# EAGLE design W076Dclone (EAGLE 6.6.0)
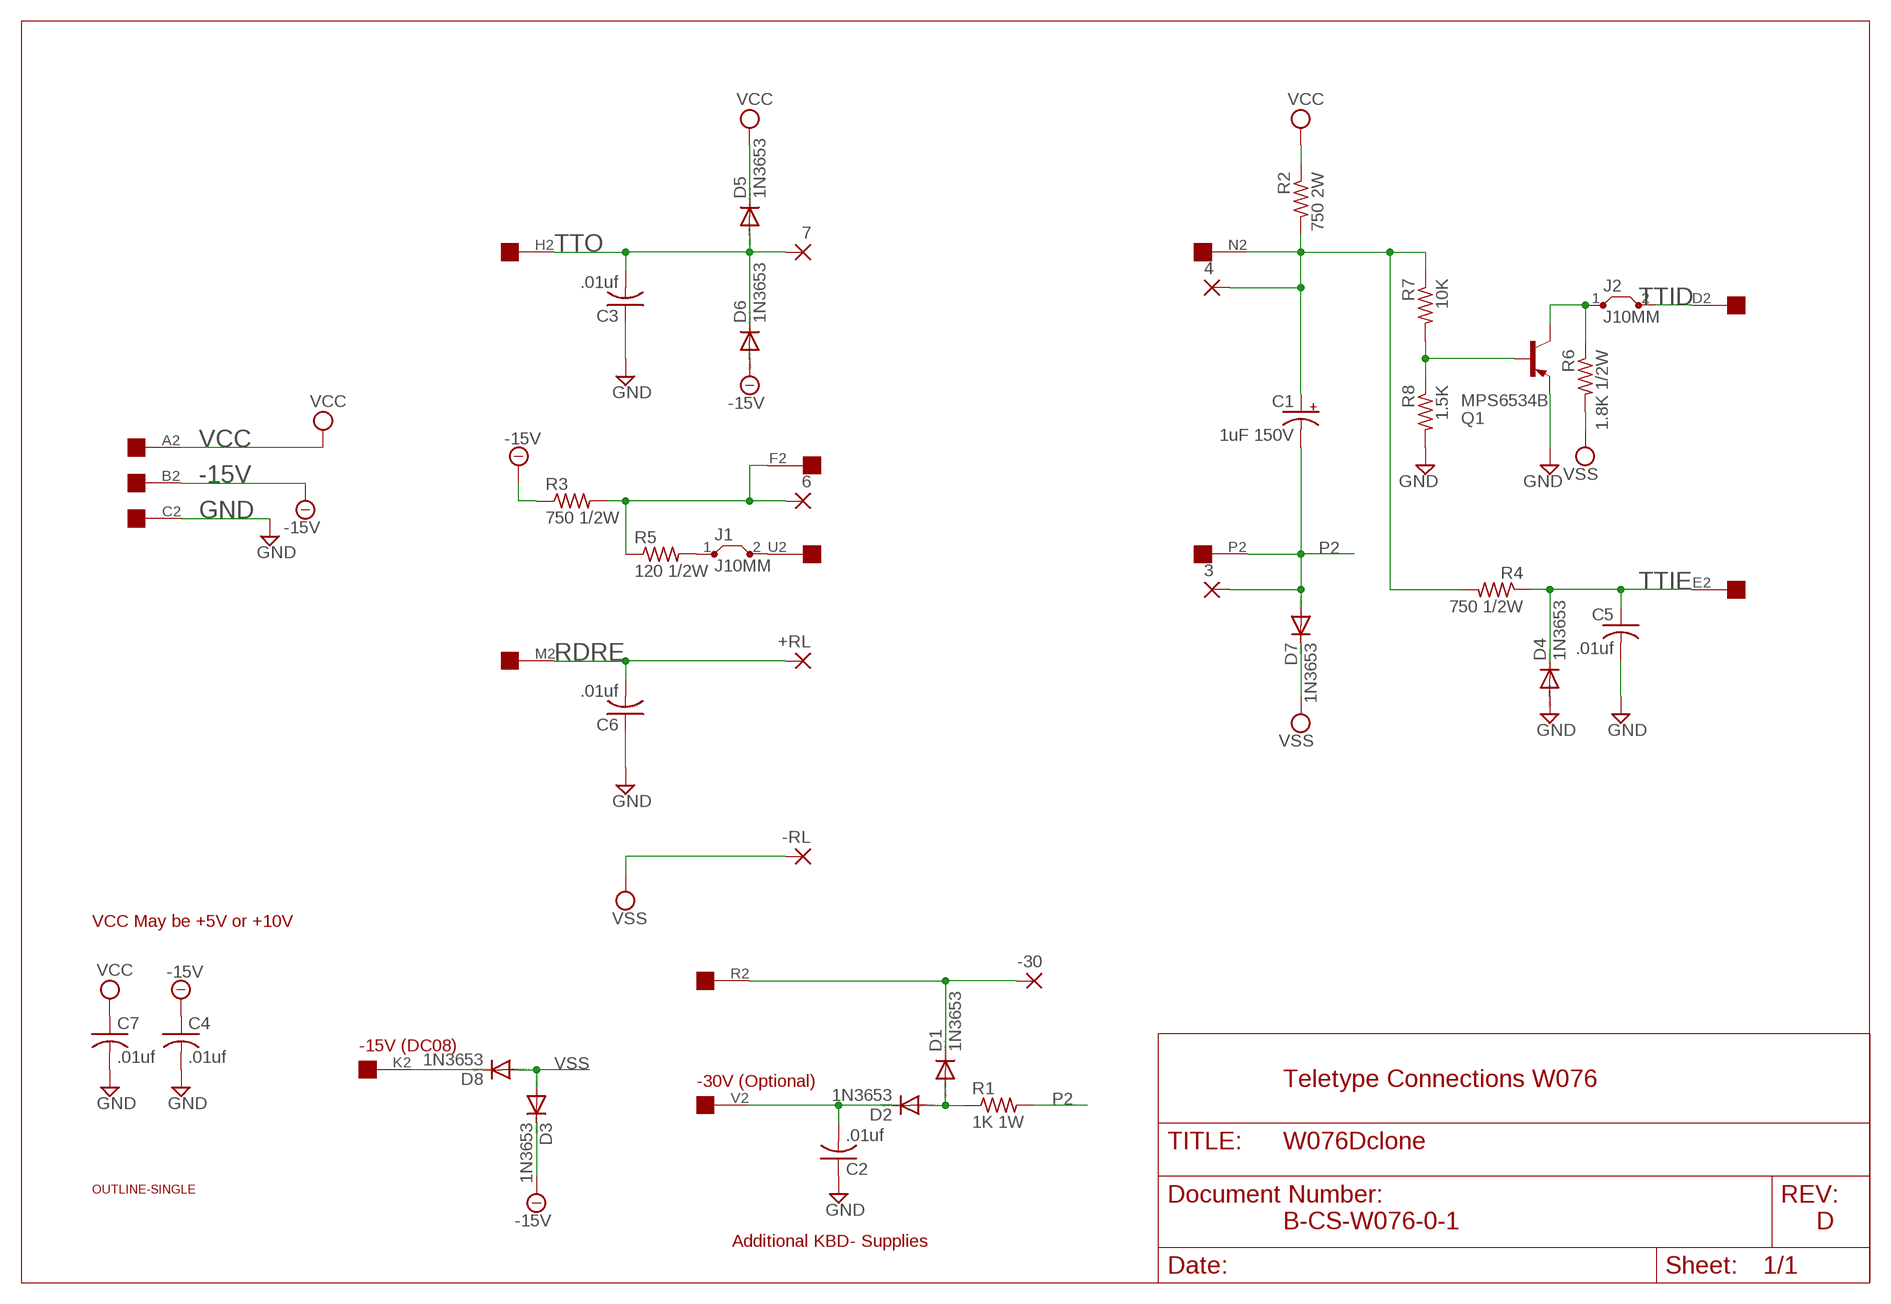
[diagram p0: schematic, sheet 1]

## Parts
3  2,54/1,0  [2,54/1,0]
4  2,54/1,0  [2,54/1,0]
6  2,54/1,0  [2,54/1,0]
7  2,54/1,0  [2,54/1,0]
+RL  2,54/1,0  [2,54/1,0]
-30  2,54/1,0  [2,54/1,0]
-RL  2,54/1,0  [2,54/1,0]
C1  1uF 150V  CPOL-USE25-9AXIAL  [E25-9]
C2  .01uf  C-US050-025X075  [C050-025X075]
C3  .01uf  C-US050-025X075  [C050-025X075]
C4  .01uf  C-US050-025X075  [C050-025X075]
C5  .01uf  C-US050-025X075  [C050-025X075]
C6  .01uf  C-US050-025X075  [C050-025X075]
C7  .01uf  C-US050-025X075  [C050-025X075]
D1  1N3653  1N4148DO35-10  [DO35-10]
D2  1N3653  1N4148DO35-10  [DO35-10]
D3  1N3653  1N4148DO35-10  [DO35-10]
D4  1N3653  1N4148DO35-10  [DO35-10]
D5  1N3653  1N4148DO35-10  [DO35-10]
D6  1N3653  1N4148DO35-10  [DO35-10]
D7  1N3653  1N4148DO35-10  [DO35-10]
D8  1N3653  1N4148DO35-10  [DO35-10]
EDGE  EDGE-1  [EDGE-CON1]
J1  J10MM  [10]
J2  J10MM  [10]
Q1  MPS6534B  2N2904  [TO39]
R1  1K 1W  R-US_0817/22  [P0817/22]
R2  750 2W  R-US_0817/22  [P0817/22]
R3  750 1/2W  R-US_0411/15  [0411/15]
R4  750 1/2W  R-US_0411/15  [0411/15]
R5  120 1/2W  R-US_0411/15  [0411/15]
R6  1.8K 1/2W  R-US_0411/15  [0411/15]
R7  10K  R-US_0411/15  [0411/15]
R8  1.5K  R-US_0411/15  [0411/15]
U$1  OUTLINE-SINGLE  [SINGLE]

## Nets
-15V: C4.1 D3.C D6.A EDGE.B2 R3.1
GND: C2.1 C3.1 C4.2 C5.2 C6.1 C7.2 D4.A EDGE.C2 Q1.1(E) R8.2
N$1: 6.1(P) EDGE.F2 R3.2 R5.1
N$2: Q1.2(B) R7.2 R8.1
N$3: -30.1(P) D1.C EDGE.R2
N$4: D8.C EDGE.K2
N$5: C2.2 D2.C EDGE.V2
N$6: D1.A D2.A R1.1
N$7: 4.1(P) C1.+ EDGE.N2 R2.2 R4.2 R7.1
N$8: J1.1 R5.2
N$9: J2.1 Q1.3(C) R6.1
P2: 3.1(P) C1.- D7.A EDGE.P2 R1.2
RDRE: +RL.1(P) C6.2 EDGE.M2
TTID: EDGE.D2 J2.2
TTIE: C5.1 D4.C EDGE.E2 R4.1
TTO: 7.1(P) C3.2 D5.A D6.C EDGE.H2
TTOE: EDGE.U2 J1.2
VCC: C7.1 D5.C EDGE.A2 R2.1
VSS: -RL.1(P) D3.A D7.C D8.A R6.2
Unconnected: EDGE.J2 EDGE.L2 EDGE.S2 EDGE.T2

## Notes on the sheet
- VCC May be +5V or +10V
- -15V (DC08)
- -30V (Optional) | Teletype Connections W076
- B-CS-W076-0-1 | D
- Additional KBD- Supplies

## Library data of the parts
3 4 6 7 +RL -30 -RL = wirepad:2,54/1,0: THROUGH-HOLE PAD
C1 = rcl:CPOL-US: POLARIZED CAPACITOR, American symbol
C2-C7 = rcl:C-US: CAPACITOR, American symbol
D1-D8 = diode:1N4148: DIODE high speed (Philips)
EDGE = dec-con:EDGE-1: Single-Sided DEC Edge Connector -- (side 2)
J1 J2 = jumper:J: Bridge
Q1 = transistor-pnp:2N2904*: PNP Transistror
R1-R8 = rcl:R-US_: RESISTOR, American symbol
U$1 = dec-con:OUTLINE-*: Board outlines for DEC boards.

## Board
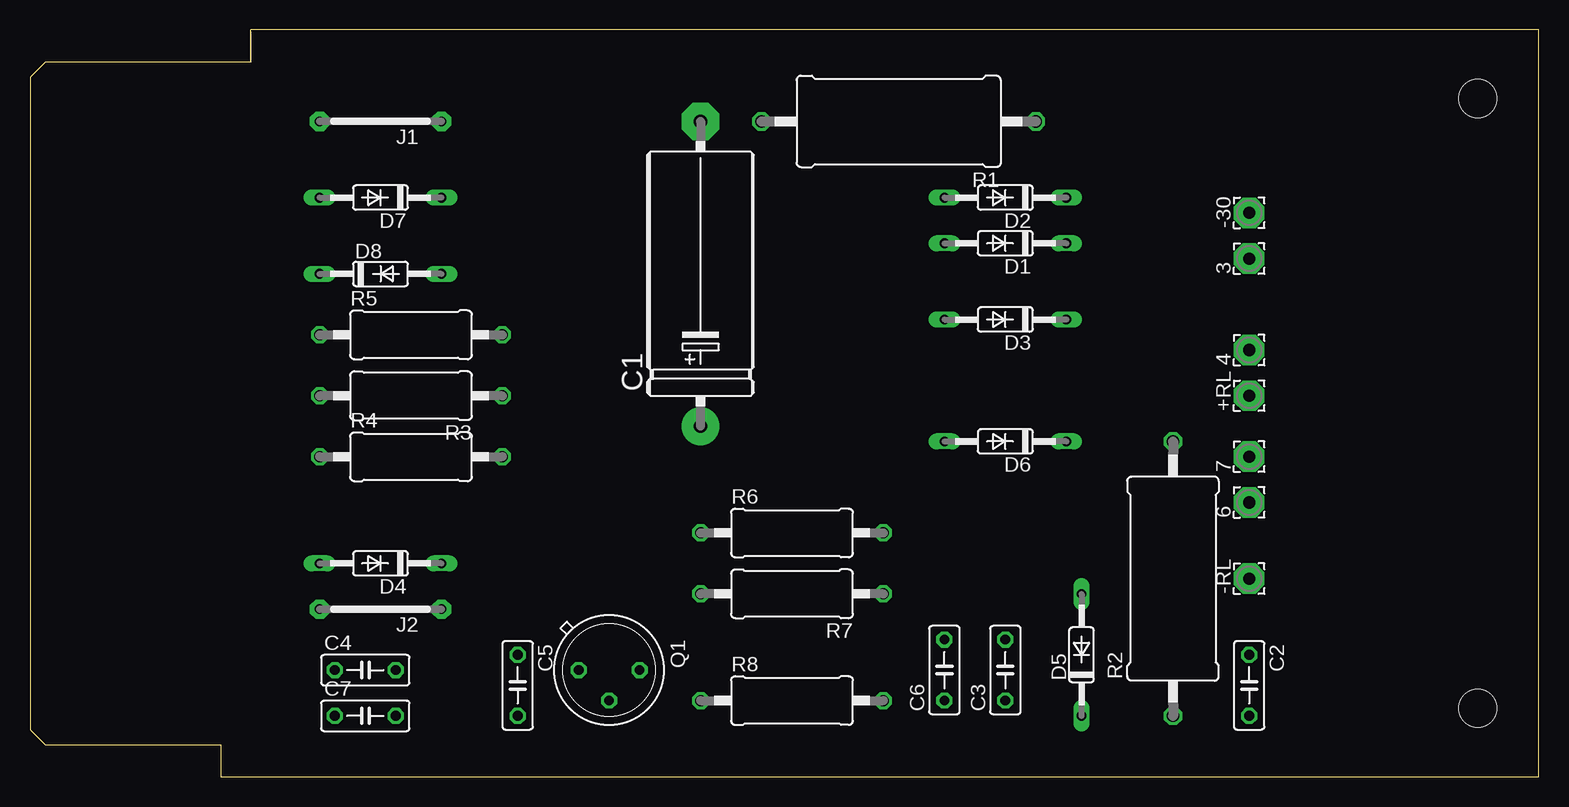
[diagram p1: board, top side]
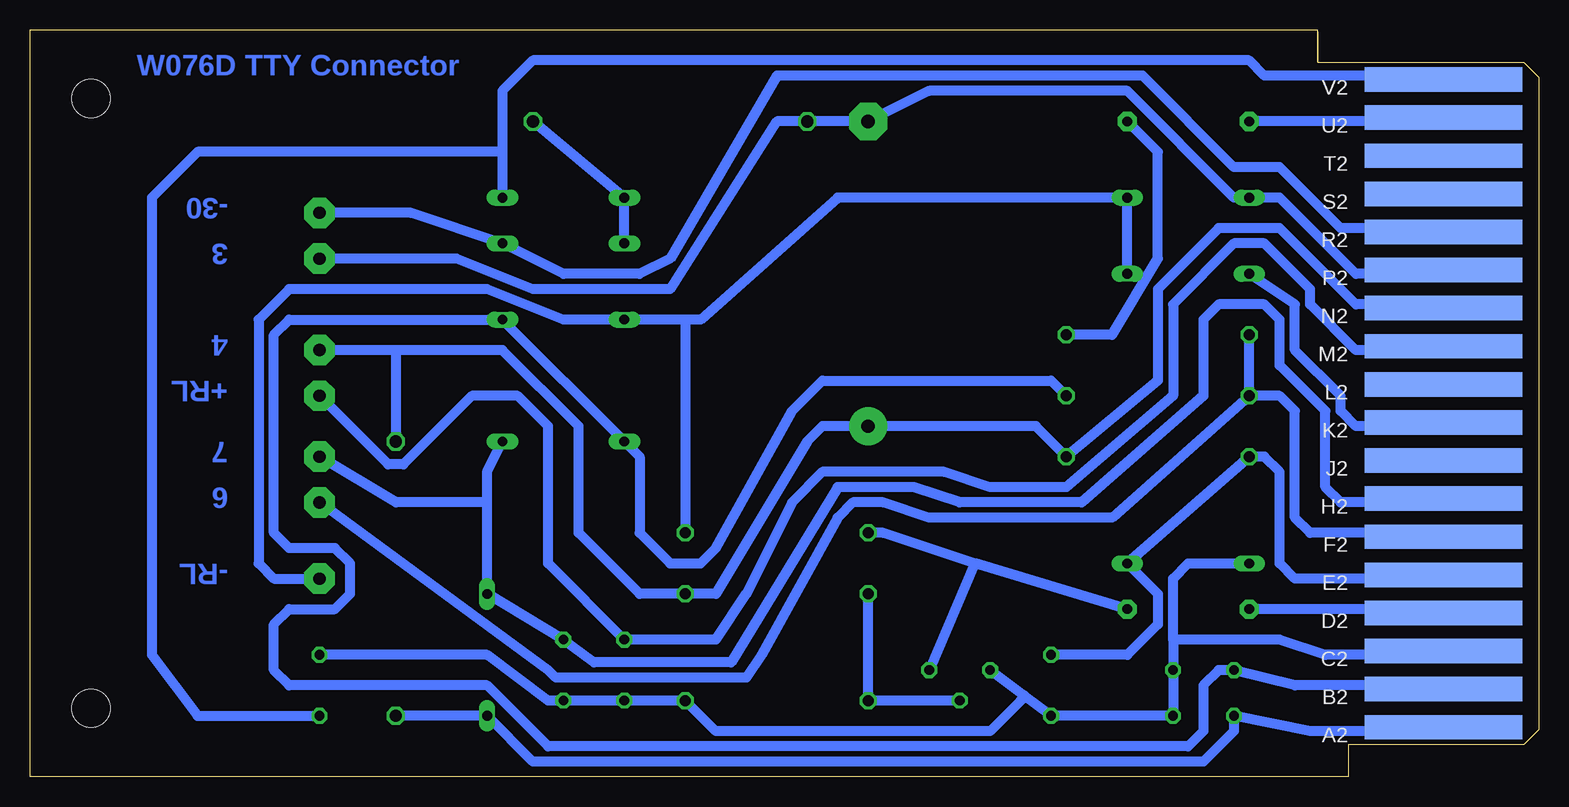
[diagram p2: board, bottom side, seen from below]

Size 125.73 x 62.23 mm. Coordinates in mm from the lower left corner, seen from the top.
Copper layers (1+16): Top 0.035mm / dielectric 1.5mm / Bottom 0.035mm
Design rules "16mils": minimum track width 16mil, minimum drill 32mil, track to track 15mil, track to pad 10mil, pad to pad 10mil, via to via 10mil, smd to smd 10mil, copper to edge 13mil, drill to drill 10mil, minimum pad ring 10mil, minimum via ring 8mil, stop-mask expansion 0mil, vias tented up to drill 0mil, thermal gap 10mil

### Footprints (pad centres in the part's own frame; a part is rotated, then mirrored left to right if it is on the bottom)
2,54/1,0 = drill 1.016 pad 2.54 octagon: 1 0,0
E25-9 = drill 1.118 pad 3.15: + -12.7,0 | drill 1.118 pad 3.15 octagon: - 12.7,0
C050-025X075 = drill 0.813 octagon: 1 -2.54,0; 2 2.54,0
DO35-10 = drill 0.813 long: A 5.08,0; C -5.08,0
EDGE-CON1 = smd 13.106 x 2.032 bottom: A2 7.938,4.128; B2 7.938,7.303; C2 7.938,10.477; D2 7.938,13.652; E2 7.938,16.828; F2 7.938,20.003; H2 7.938,23.177; J2 7.938,26.352; K2 7.938,29.527; L2 7.938,32.703; M2 7.938,35.877; N2 7.938,39.053; P2 7.938,42.227; R2 7.938,45.403; S2 7.938,48.578; T2 7.938,51.752; U2 7.938,54.928; V2 7.938,58.102
10 = drill 0.813 pad 1.6 octagon: 1 -5.08,0; 2 5.08,0
TO39 = drill 0.813 octagon: 1 0,-2.54; 2 2.54,0; 3 0,2.54
P0817/22 = drill 1.016 octagon: 1 -11.43,0; 2 11.43,0
0411/15 = drill 0.914 octagon: 1 -7.62,0; 2 7.62,0
SINGLE = hole 3.175: 120.65,56.515; 120.65,5.715

### Placement (x,y rotation side)
3  101.6,43.18 90 top
4  101.6,35.56 90 top
6  101.6,22.86 90 top
7  101.6,26.67 90 top
+RL  101.6,31.75 90 top
-30  101.6,46.99 90 top
-RL  101.6,16.51 90 top
C1  55.88,41.91 90 top
C2  101.6,7.62 270 top
C3  81.28,8.89 90 top
C4  27.94,8.89 0 top
C5  40.64,7.62 270 top
C6  76.2,8.89 90 top
C7  27.94,5.08 0 top
D1  81.28,44.45 180 top
D2  81.28,48.26 180 top
D3  81.28,38.1 180 top
D4  29.21,17.78 180 top
D5  87.63,10.16 90 top
D6  81.28,27.94 180 top
D7  29.21,48.26 180 top
D8  29.21,41.91 0 top
EDGE  0,0 0 top
J1  29.21,54.61 180 top
J2  29.21,13.97 180 top
Q1  48.26,8.89 270 top
R1  72.39,54.61 180 top
R2  95.25,16.51 90 top
R3  31.75,31.75 180 top
R4  31.75,26.67 0 top
R5  31.75,36.83 0 top
R6  63.5,20.32 0 top
R7  63.5,15.24 180 top
R8  63.5,6.35 0 top
U$1  0,0 0 top

### Tracks (layer width: path | path; a pad name or v marks a point on that pad's centre or on a via)
-15V
  Bottom 0.813: EDGE.B2 8.89,7.62 20.32,7.62 C4.1 26.67,8.89 27.94,7.62 27.94,3.81 29.21,2.54 82.55,2.54 87.63,7.62 104.14,7.62 105.41,8.89 105.41,12.7 104.14,13.97 100.33,13.97 99.06,15.24 99.06,17.78 100.33,19.05 104.14,19.05 105.41,20.32 105.41,36.83 104.14,38.1 D3.C D6.A 74.93,26.67 74.93,20.32 72.39,17.78 69.85,17.78 68.58,19.05 62.23,30.48 59.69,33.02 40.64,33.02 R3.1
GND
  Bottom 0.813: EDGE.C2 8.89,10.16 17.78,10.16 21.59,11.43 30.48,11.43 | 30.48,11.43 C4.2 C7.2 C5.2 42.88,6.76 | D4.A 29.21,17.78 30.48,16.51 30.48,11.43 | 42.88,6.76 Q1.1 | 42.88,6.76 43.18,6.35 45.72,3.81 68.58,3.81 R8.2 C6.1 C3.1 82.55,6.35 87.63,10.16 C2.1
N$1
  Bottom 0.813: EDGE.F2 8.89,20.32 19.05,20.32 20.32,21.59 20.32,30.48 21.59,31.75 R3.2 | R3.2 R5.1 | R3.2 35.56,21.59 50.8,21.59 54.61,22.86 57.15,22.86 58.42,21.59 64.77,10.16 66.04,8.26 81.92,8.26 82.55,8.89 6.1
N$2
  Bottom 0.813: Q1.2 R8.1 R7.2
N$3
  Bottom 0.813: EDGE.R2 8.89,45.72 16.51,45.72 21.59,50.8 25.4,50.8 33.02,58.42 63.5,58.42 72.39,43.18 74.93,41.91 81.28,41.91 D1.C 93.98,46.99 -30.1
N$4
  Bottom 0.813: EDGE.K2 8.89,29.21 15.24,29.21 16.51,30.48 16.51,31.75 20.32,35.56 20.32,39.37 D8.C
N$5
  Bottom 0.813: EDGE.V2 8.89,58.42 22.86,58.42 24.13,59.69 83.82,59.69 86.36,57.15 86.36,52.07 | 86.36,52.07 D2.C | C2.2 111.76,5.08 115.57,10.16 115.57,48.26 111.76,52.07 86.36,52.07
N$6
  Bottom 0.813: R1.1 D2.A D1.A
N$7
  Bottom 0.813: EDGE.N2 8.89,39.37 15.24,39.37 21.59,45.72 26.67,45.72 31.75,40.64 31.75,33.02 R4.2 41.91,29.21 C1.+ 59.69,29.21 60.96,27.94 68.58,15.24 R7.1 74.93,15.24 80.01,20.32 80.01,29.21 86.36,35.56 95.25,35.56 | 95.25,35.56 4.1 | 95.25,35.56 R2.2
N$8
  Bottom 0.813: J1.1 31.75,52.07 31.75,43.18 35.56,36.83 R5.2
N$9
  Bottom 0.813: J2.1 46.99,17.78 | 46.99,17.78 54.61,20.32 R6.1 | 46.99,17.78 Q1.3
P2
  Bottom 0.813: EDGE.P2 8.89,41.91 15.24,41.91 21.59,48.26 D7.A 25.4,48.26 34.29,57.15 50.8,57.15 C1.- R1.2 63.5,54.61 72.39,40.64 83.82,40.64 90.17,43.18 3.1
RDRE
  Bottom 0.813: EDGE.M2 8.89,35.56 15.24,35.56 19.05,39.37 19.05,40.64 22.86,44.45 25.4,44.45 30.48,39.37 30.48,31.75 39.37,24.13 45.72,24.13 49.53,25.4 59.69,25.4 62.23,22.86 66.04,15.24 68.58,11.43 C6.2 82.55,17.78 82.55,29.21 85.09,31.75 88.9,31.75 94.62,26.04 95.89,26.04 +RL.1
TTID
  Bottom 0.813: EDGE.D2 8.89,13.97 J2.2
TTIE
  Bottom 0.813: EDGE.E2 8.89,16.51 20.32,16.51 21.59,17.78 21.59,25.4 22.86,26.67 R4.1 D4.C 31.75,15.24 31.75,12.7 34.29,10.16 C5.1
TTO
  Bottom 0.813: EDGE.H2 8.89,22.86 16.51,22.86 17.78,24.13 17.78,30.48 21.59,34.29 21.59,38.1 22.86,39.37 26.67,39.37 27.94,38.1 27.94,31.75 38.1,22.86 48.26,22.86 52.07,24.13 58.42,24.13 67.31,9.53 78.74,9.53 C3.2 D5.A 87.63,22.86 | D6.C 87.63,25.4 87.63,22.86 | 7.1 95.25,22.86 87.63,22.86
TTOE
  Bottom 0.813: EDGE.U2 8.89,54.61 J1.2
VCC
  Bottom 0.813: EDGE.A2 8.26,3.81 19.05,3.81 C7.1 25.4,3.81 27.94,1.27 83.82,1.27 D5.C R2.1
VSS
  Bottom 0.813: D8.A D7.C 58.42,48.26 69.85,38.1 71.12,38.1 | 71.12,38.1 D3.A 81.28,38.1 87.63,40.64 104.14,40.64 106.68,38.1 106.68,17.78 105.41,16.51 -RL.1 | 71.12,38.1 R6.2

### Text on the board
Bottom: W076D TTY Connector | -30 | 3 | 4 | +RL | 7 | 6 | -RL